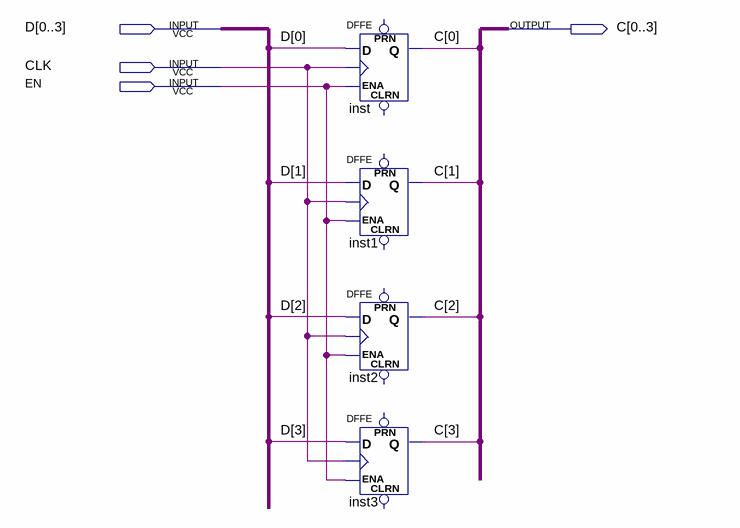
[diagram p0: schematic sheet]
// Quartus schematic reg4bit.bdf as structural Verilog: 4 symbols, 4 pins
module reg4bit (
  input  [0:3] D,
  input  CLK,
  input  EN,
  output [0:3] C
);

  DFFE inst (.D(D[0]), .CLK(CLK), .ENA(EN), .Q(C[0]));  // open: PRN, CLRN
  DFFE inst1 (.D(D[1]), .CLK(CLK), .ENA(EN), .Q(C[1]));  // open: PRN, CLRN
  DFFE inst2 (.D(D[2]), .CLK(CLK), .ENA(EN), .Q(C[2]));  // open: PRN, CLRN
  DFFE inst3 (.D(D[3]), .CLK(CLK), .ENA(EN), .Q(C[3]));  // open: PRN, CLRN
endmodule
